# Altium schematic sheet HeroRobot.SchDoc
size A4
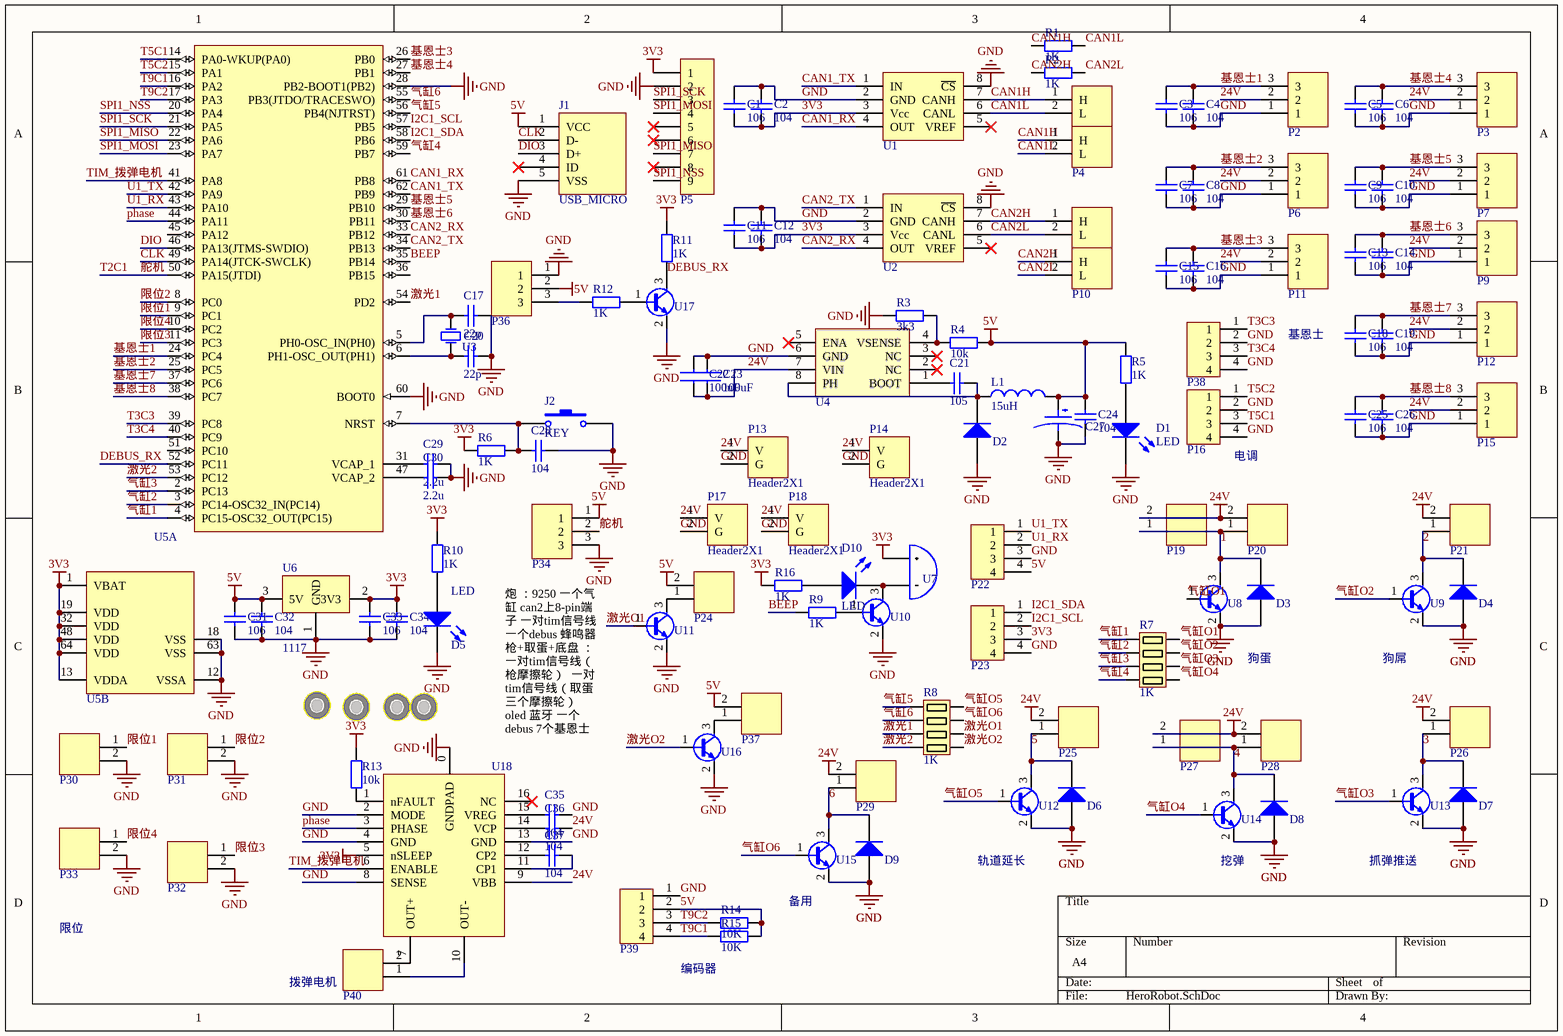
[diagram p0: HeroRobot.SchDoc]

## Parts
1  Via_M3  [Via_M3]  (value not drawn)
2  Via_M3  [Via_M3]  (value not drawn)
3  Via_M3  [Via_M3]  (value not drawn)
4  Via_M3  [Via_M3]  (value not drawn)
C1  106  [0603C]
C2  104  [0603C]
C3  106  [0603C]
C4  104  [0603C]
C5  106  [0603C]
C6  104  [0603C]
C7  106  [0603C]
C8  104  [0603C]
C9  106  [0603C]
C10  104  [0603C]
C11  106  [0603C]
C12  104  [0603C]
C13  106  [0603C]
C14  104  [0603C]
C15  106  [0603C]
C16  104  [0603C]
C17  22p  [0603C]
C18  106  [0603C]
C19  104  [0603C]
C20  22p  [0603C]
C21  105  [0603C]
C22  100uF  [1201C]
C23  100uF  [1201C]
C24  104  [0603C]
C25  106  [0603C]
C26  104  [0603C]
C27  CAP_钽220  [cap_钽E封装]  (value not drawn)
C28  104  [0603C]
C29  2.2u  [0603C]
C30  2.2u  [0603C]
C31  106  [0603C]
C32  104  [0603C]
C33  106  [0603C]
C34  104  [0603C]
C35  104  [0603C]
C36  104  [0603C]
C37  104  [0603C]
D1  LED  [LED_0603]
D2  Diode_SS34  [Diode_SS34]  (value not drawn)
D3  Diode_SS34  [Diode_SS34]  (value not drawn)
D4  Diode_SS34  [Diode_SS34]  (value not drawn)
D5  LED  [LED_0603]
D6  Diode_SS34  [Diode_SS34]  (value not drawn)
D7  Diode_SS34  [Diode_SS34]  (value not drawn)
D8  Diode_SS34  [Diode_SS34]  (value not drawn)
D9  Diode_SS34  [Diode_SS34]  (value not drawn)
D10  LED  [LED_0603]
J1  USB_MICRO  [USB_MICRO]
J2  KEY  [KEY]
L1  15uH  [Inductor7.2X7.2]
P1  Header_CAN  [Header2_3002]  (value not drawn)
P2  Header3  [Header3_white]  (value not drawn)
P3  Header3  [Header3_white]  (value not drawn)
P4  Header_CAN  [Header2_3002]  (value not drawn)
P5  Header9  [Header9]  (value not drawn)
P6  Header3  [Header3_white]  (value not drawn)
P7  Header3  [Header3_white]  (value not drawn)
P8  Header_CAN  [Header2_3002]  (value not drawn)
P9  Header3  [Header3_white]  (value not drawn)
P10  Header_CAN  [Header2_3002]  (value not drawn)
P11  Header3  [Header3_white]  (value not drawn)
P12  Header3  [Header3_white]  (value not drawn)
P13  Header2X1  [Header_POWER]
P14  Header2X1  [Header_POWER]
P15  Header3  [Header3_white]  (value not drawn)
P16  Header4  [Header4_white]  (value not drawn)
P17  Header2X1  [Header_POWER]
P18  Header2X1  [Header_POWER]
P19  Header  [Header2_white]  (value not drawn)
P20  Header  [Header2_white]  (value not drawn)
P21  Header  [Header2_white]  (value not drawn)
P22  Header4  [Header4]  (value not drawn)
P23  Header4  [Header4]  (value not drawn)
P24  Header  [Header2_white]  (value not drawn)
P25  Header  [Header2_white]  (value not drawn)
P26  Header  [Header2_white]  (value not drawn)
P27  Header  [Header2_white]  (value not drawn)
P28  Header  [Header2_white]  (value not drawn)
P29  Header  [Header2_white]  (value not drawn)
P30  Header  [Header2_white]  (value not drawn)
P31  Header  [Header2_white]  (value not drawn)
P32  Header  [Header2_white]  (value not drawn)
P33  Header  [Header2_white]  (value not drawn)
P34  Header3  [Header3_white]  (value not drawn)
P36  Header3  [Header3_white]  (value not drawn)
P37  Header  [Header2_white]  (value not drawn)
P38  Header4  [Header4_white]  (value not drawn)
P39  Header4  [Header4_white]  (value not drawn)
P40  Header  [Header2_white]  (value not drawn)
R1  1K  [0603R]
R2  1K  [0603R]
R3  3k3  [0603R]
R4  10k  [0603R]
R5  1K  [0603R]
R6  1K  [0603R]
R7  1K  [8P4R_0603]
R8  1K  [8P4R_0603]
R9  1K  [0603R]
R10  1K  [0603R]
R11  1K  [0603R]
R12  1K  [0603R]
R13  10k  [0603R]
R14  10K  [0603R]
R15  10K  [0603R]
R16  1K  [0603R]
U1  VD230  [SO_8]  (value not drawn)
U2  VD230  [SO_8]  (value not drawn)
U3  XTAL  [XATL_8M]  (value not drawn)
U4  TPS5430/5450  [TPS5430]  (value not drawn)
U5  STM32F405RGT6(F103RCT6)  [LQFP_64Pins - duplicate]  (value not drawn)  (parts A,B of 2)
U6  1117  [SOT-223]
U7  Bell  [BELL_无源]  (value not drawn)
U8  BJT-2N5551  [SOT_23]  (value not drawn)
U9  BJT-2N5551  [SOT_23]  (value not drawn)
U10  BJT-2N5551  [SOT_23]  (value not drawn)
U11  BJT-2N5551  [SOT_23]  (value not drawn)
U12  BJT-2N5551  [SOT_23]  (value not drawn)
U13  BJT-2N5551  [SOT_23]  (value not drawn)
U14  BJT-2N5551  [SOT_23]  (value not drawn)
U15  BJT-2N5551  [SOT_23]  (value not drawn)
U16  BJT-2N5551  [SOT_23]  (value not drawn)
U17  BJT-2N5551  [SOT_23]  (value not drawn)
U18  DRV8800  [HTSSOP]  (value not drawn)

## Nets
3V3: C1.1 C2.1 C11.1 C12.1 C33.2 C34.2 P5.1 P23.3 R6.2 R10.2 R11.2 R13.2 R16.1 U1.3(Vcc) U2.3(Vcc) U5.1(VBAT) U5.13(VDDA) U5.19(VDD) U5.32(VDD) U5.48(VDD) U5.64(VDD) U6.2(3V3) U7.1(A) U18.5(nSLEEP)
5V: C24.2 C27.2 C31.2 C32.2 J1.1(VCC) L1.2 P22.4 P24.2 P34.1 P36.2 P37.2 P39.2 R4.1 R5.2 R14.2 R15.2 U6.3(5V)
24V: C22.1 C23.1 C36.2 P2.2 P3.2 P6.2 P7.2 P9.2 P11.2 P12.2 P13.1(V) P14.1(V) P15.2 P17.1(V) P18.1(V) P19.2 P20.2 P21.2 P25.2 P26.2 P27.2 P28.2 P29.2 U4.7(VIN) U18.9(VBB)
GND: C1.2 C2.2 C3.1 C4.1 C5.1 C6.1 C7.1 C8.1 C9.1 C10.1 C11.2 C12.2 C13.1 C14.1 C15.1 C16.1 C17.2 C18.1 C19.1 C20.2 C22.2 C23.2 C24.1 C25.1 C26.1 C27.1 C28.2 C29.2 C30.2 C31.1 C32.1 C33.1 C34.1 C35.2 D1.2(K) D2.1(A) D3.1(A) D4.1(A) D5.2(K) D6.1(A) D7.1(A) D8.1(A) D9.1(A) J1.5(VSS) J2.2 P2.1 P3.1 P5.2 P6.1 P7.1 P9.1 P11.1 P12.1 P13.2(G) P14.2(G) P15.1 P16.2 P16.4 P17.2(G) P18.2(G) P22.3 P23.4 P30.2 P31.2 P32.2 P33.2 P34.3 P36.1 P38.2 P38.4 P39.1 R3.2 U1.2(GND) U1.8(~{CS}) U2.2(GND) U2.8(~{CS}) U4.6(GND) U5.12(VSSA) U5.18(VSS) U5.28(PB2-BOOT1(PB2)) U5.60(BOOT0) U5.63(VSS) U6.1(GND) U8.2(b) U9.2(b) U10.2(b) U11.2(b) U12.2(b) U13.2(b) U14.2(b) U15.2(b) U16.2(b) U17.2(b) U18.0(GNDPAD) U18.2(MODE) U18.4(GND) U18.8(SENSE) U18.13(GND)
1: D3.2(K) P19.1 P20.1 U8.3(c)
2: D4.2(K) P21.1 U9.3(c)
3: D7.2(K) P26.1 U13.3(c)
4: D8.2(K) P27.1 P28.1 U14.3(c)
5: D6.2(K) P25.1 U12.3(c)
6: D9.2(K) P29.1 U15.3(c)
BEEP: R9.2 U5.35(PB14)
CAN1_RX: U1.4(OUT) U5.61(PB8)
CAN1_TX: U1.1(IN) U5.62(PB9)
CAN1H: P1.1(H) P4.1(H) R1.1 U1.7(CANH)
CAN1L: P1.2(L) P4.2(L) R1.2 U1.6(CANL)
CAN2_RX: U2.4(OUT) U5.33(PB12)
CAN2_TX: U2.1(IN) U5.34(PB13)
CAN2H: P8.1(H) P10.1(H) R2.1 U2.7(CANH)
CAN2L: P8.2(L) P10.2(L) R2.2 U2.6(CANL)
CLK: J1.2(D-) U5.49(PA14(JTCK-SWCLK))
DEBUS_RX: R11.1 U5.52(PC11) U17.3(c)
DIO: J1.3(D+) U5.46(PA13(JTMS-SWDIO))
I2C1_SCL: P23.2 U5.57(PB5)
I2C1_SDA: P23.1 U5.58(PB6)
phase: U5.44(PA11) U18.3(PHASE)
SPI1_MISO: P5.7 U5.22(PA6)
SPI1_MOSI: P5.4 U5.23(PA7)
SPI1_NSS: P5.9 U5.20(PA4)
SPI1_SCK: P5.3 U5.21(PA5)
T2C1: P34.2 U5.50(PA15(JTDI))  [also labelled 舵机]
T3C3: P38.1 U5.39(PC8)
T3C4: P38.3 U5.40(PC9)
T5C1: P16.3 U5.14(PA0-WKUP(PA0))
T5C2: P16.1 U5.15(PA1)
T9C1: P39.4 R15.1 U5.16(PA2)
T9C2: P39.3 R14.1 U5.17(PA3)
TIM_拨弹电机: U5.41(PA8) U18.6(ENABLE)
U1_RX: P22.2 U5.43(PA10)
U1_TX: P22.1 U5.42(PA9)
基恩士1: C3.2 C4.2 P2.3 U5.24(PC4)
基恩士2: C7.2 C8.2 P6.3 U5.25(PC5)
基恩士3: C15.2 C16.2 P11.3 U5.26(PB0)
基恩士4: C5.2 C6.2 P3.3 U5.27(PB1)
基恩士5: C9.2 C10.2 P7.3 U5.29(PB10)
基恩士6: C13.2 C14.2 P9.3 U5.30(PB11)
基恩士7: C18.2 C19.2 P12.3 U5.37(PC6)
基恩士8: C25.2 C26.2 P15.3 U5.38(PC7)
气缸1: R7.1 U5.4(PC15-OSC32_OUT(PC15))
气缸2: R7.2 U5.3(PC14-OSC32_IN(PC14))
气缸3: R7.3 U5.2(PC13)
气缸4: R7.4 U5.59(PB7)
气缸5: R8.1 U5.56(PB4(NJTRST))
气缸6: R8.2 U5.55(PB3(JTDO/TRACESWO))
气缸O1: R7.8 U8.1(e)
气缸O2: R7.7 U9.1(e)
气缸O3: R7.6 U13.1(e)
气缸O4: R7.5 U14.1(e)
气缸O5: R8.8 U12.1(e)
气缸O6: R8.7 U15.1(e)
激光1: R8.3 U5.54(PD2)
激光2: R8.4 U5.53(PC12)
激光O1: R8.6 U11.1(e)
激光O2: R8.5 U16.1(e)
限位1: P30.1 U5.9(PC1)
限位2: P31.1 U5.8(PC0)
限位3: P32.1 U5.11(PC3)
限位4: P33.1 U5.10(PC2)
NetC17_1: C17.1 U3.1(OSC1) U5.5(PH0-OSC_IN(PH0))
NetC20_1: C20.1 U3.2(OSC2) U5.6(PH1-OSC_OUT(PH1))
NetC21_1: C21.1 D2.2(K) L1.1 U4.8(PH)
NetC21_2: C21.2 U4.1(BOOT)
NetC28_1: C28.1 J2.1 R6.1 U5.7(NRST)
NetC29_1: C29.1 U5.31(VCAP_1)
NetC30_1: C30.1 U5.47(VCAP_2)
NetC35_1: C35.1 U18.15(VREG)
NetC36_1: C36.1 U18.14(VCP)
NetC37_1: C37.1 U18.12(CP2)
NetC37_2: C37.2 U18.11(CP1)
NetD1_1: D1.1(A) R5.1
NetD5_1: D5.1(A) R10.1
NetD10_1: D10.1(A) R16.2
NetD10_2: D10.2(K) U7.2(B) U10.3(c)
NetP24_1: P24.1 U11.3(c)
NetP36_3: P36.3 R12.2
NetP37_1: P37.1 U16.3(c)
NetP40_1: P40.1 U18.10(OUT-)
NetP40_2: P40.2 U18.7(OUT+)
NetR3_1: R3.1 R4.2 U4.4(VSENSE)
NetR9_1: R9.1 U10.1(e)
NetR12_1: R12.1 U17.1(e)
NetR13_1: R13.1 U18.1(nFAULT)

Not connected (* = marked no-connect by the designer): J1 4(ID)*; P5 5* 6* 8*; U1 5(VREF)*; U2 5(VREF)*; U4 2(NC)* 3(NC)* 5(ENA)*; U5 36(PB15) 45(PA12) 51(PC10); U18 16(NC)*

## Notes on the sheet
- 基恩士
- (near P16) 电调
- 狗蛋
- (near U9) 狗屌
- 炮 ：9250 一个气缸 can2上8-pin端子 一对tim信号线 一个debus 蜂鸣器
  枪+取蛋+底盘 ：一对tim信号线（枪摩擦轮）  一对tim信号线（取蛋三个摩擦轮） oled 蓝牙 一个debus 7个基恩士（可能多）
  5个气缸（可能多） 三个激光 拨蛋电机 蜂鸣器 一个普通输出io口与树莓派通信 一个舵机控制图传 5v电源接口（给树莓派供电，可开关）
  暂时目前新车电路需求 待补充
- 备用
- (near U12) 轨道延长
- (near U14) 挖弹
- (near U13) 抓弹推送
- 限位
- 拨弹电机
- 编码器

## Library data of the parts
C1 C3 C5 C7 C9 C11 C13 C15 C18 C21 C25 C31 C33 = C_106: 0603/0805
  C1 C3 C5 C7 C9 C11 C13 C15 C18 C25 C31 C33: Value: 106
  C21: Value: 105
C2 C4 C6 C8 C10 C12 C14 C16 C17 C19 C20 C24 C26 C28-C30 C32 C34-C37 = C_104: 0603/0805
  C2 C4 C6 C8 C10 C12 C14 C16 C19 C24 C26 C28 C32 C34-C37: Value: 104
  C17 C20: Value: 22p
  C29 C30: Value: 2.2u
C22 C23 = CAP100uF: Value: 100uF
C27 = CAP_钽220: CAP
D2-D4 D6-D9 = Diode_SS34: 肖特基二极管
L1 = Inductor: 屏蔽电感
P13 P14 P17 P18 = Header2X1: power
P19-P21 P24-P33 P37 P40 = Header2
R1-R6 R9-R16 = R: 0603/0805
  R1 R2 R5 R6 R9-R12 R16: Value: 1k
  R3: Value: 3k3
  R4 R13: Value: 10k
  R14 R15: Value: 10K
R7 R8 = R_8P4R: value: 1k
U1 U2 = VD230: SO-8
U4 = TPS5430/5450: 降压
U5 = STM32F405RGT6(F103RCT6): 64PINS
U6 = AMS1117-3.3
U18 = DRV8800: HTSSOP